# Altium schematic sheet 3144E.SchDoc
size A4
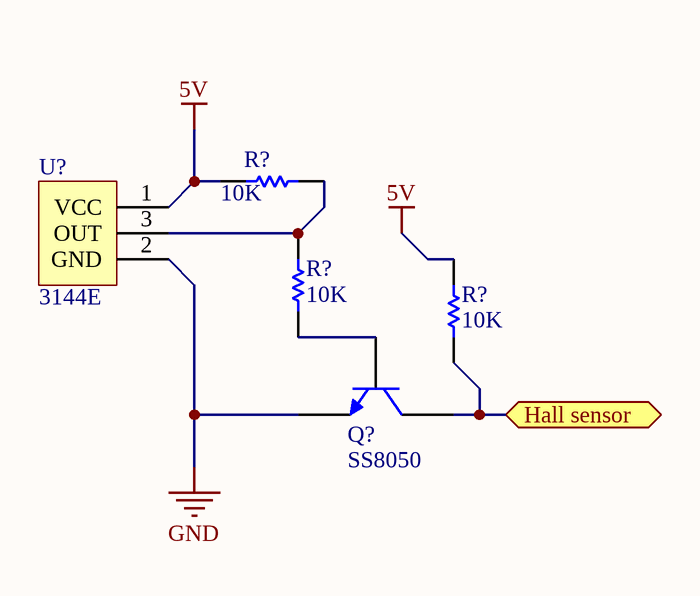
[diagram p0: 3144E.SchDoc]

## Parts
(Parts that share a designator on the sheet are numbered #1, #2 ... from top to bottom, then left to right.)
Q?  SS8050  [TO-92A]
R?#1  value 10K  [AXIAL-0.3]  (hidden comment: Res1)
R?#2  value 10K  [AXIAL-0.3]  (hidden comment: Res1)
R?#3  value 10K  [AXIAL-0.3]  (hidden comment: Res1)
U?  3144E  [TO-92A]

## Ports
Hall sensor (bidir)

## Nets
5V: R?#1.2 R?#3.2 U?.1(VCC)
GND: Q?.1(E) U?.2(GND)
Hall sensor: Q?.3(C) R?#3.1 ; port Hall sensor
NetQ?_2: Q?.2(B) R?#2.1
NetR?#1_1: R?#1.1 R?#2.2 U?.3(OUT)

## Library data of the parts
Q? = 2N3904: NPN General Purpose Amplifier; Published: 8-Jun-2000; LatestRevisionDate: 15-Jan-2003; LatestRevisionNote: PCB Footprint 'BCY-W3/D4.7' replaced; DatasheetVersion: 1997; PackageVersion: Sep-1998; PackageReference: TO-92A; Publisher: Altium Limited; PackageDescription: TO, Flat Index; 3 In-Line, Axial Leads; Body Dia. 4.5mm; Leads 0.51 x 0.48 mm (max); ComponentLink1Description: Manufacturer Link; ComponentLink1URL: http://www.fairchildsemi.com/; ComponentLink2Description: Datasheet; ComponentLink2URL: http://www.fairchildsemi.com/ds/2N%2F2N3904.pdf
R?#1-R?#3 = Res1: Resistor; Published: 8-Jun-2000; LatestRevisionDate: 17-Jul-2002; LatestRevisionNote: Re-released for DXP Platform.; PackageReference: AXIAL-0.3; Publisher: Altium Limited; PackageDescription: Axial Device, Thru-Hole; 2 Leads; 0.3 in Pin Spacing
U? = 3144E: 开关式霍尔传感器